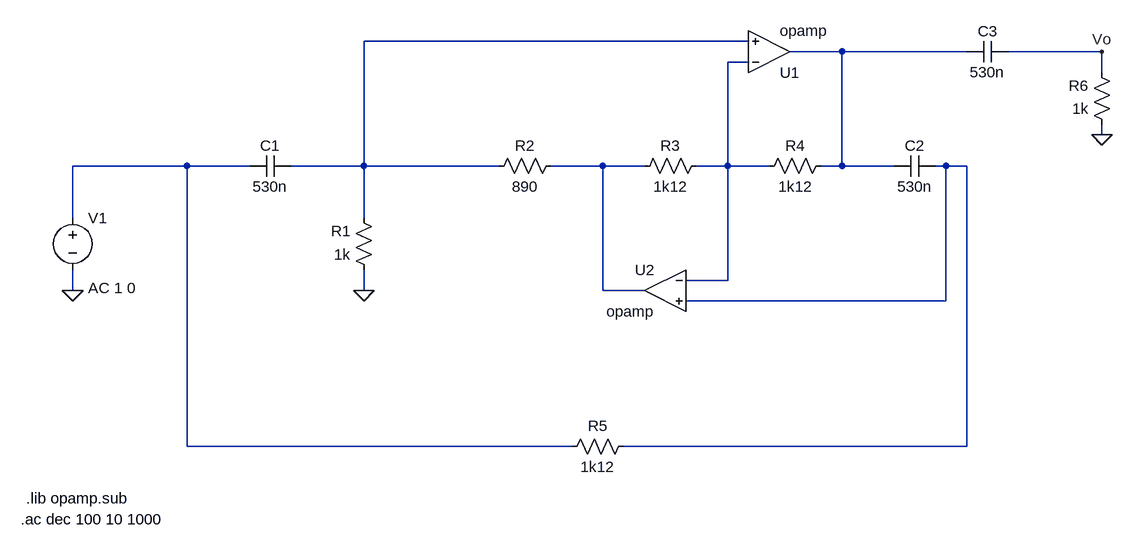
[diagram p0: schematic sim_circuital.asc]
sim_circuital.asc, the LTspice schematic file:
Version 4
SHEET 1 1048 680
WIRE 464 -256 -128 -256
WIRE 608 -240 528 -240
WIRE 800 -240 608 -240
WIRE 1008 -240 864 -240
WIRE 464 -224 432 -224
WIRE 1008 -208 1008 -240
WIRE 1008 -112 1008 -128
WIRE -400 -64 -576 -64
WIRE -304 -64 -400 -64
WIRE -128 -64 -128 -256
WIRE -128 -64 -240 -64
WIRE 80 -64 -128 -64
WIRE 240 -64 160 -64
WIRE 304 -64 240 -64
WIRE 432 -64 432 -224
WIRE 432 -64 384 -64
WIRE 496 -64 432 -64
WIRE 608 -64 608 -240
WIRE 608 -64 576 -64
WIRE 688 -64 608 -64
WIRE 768 -64 752 -64
WIRE 800 -64 768 -64
WIRE -576 16 -576 -64
WIRE -128 16 -128 -64
WIRE 432 112 432 -64
WIRE 432 112 368 112
WIRE -576 128 -576 96
WIRE -128 128 -128 96
WIRE 240 128 240 -64
WIRE 304 128 240 128
WIRE 768 144 768 -64
WIRE 768 144 368 144
WIRE -400 368 -400 -64
WIRE 192 368 -400 368
WIRE 800 368 800 -64
WIRE 800 368 272 368
FLAG -576 128 0
FLAG -128 128 0
FLAG 1008 -240 Vo
FLAG 1008 -112 0
SYMBOL res -112 112 R180
WINDOW 0 36 76 Left 2
WINDOW 3 36 40 Left 2
SYMATTR InstName R1
SYMATTR Value 1k
SYMBOL res 64 -48 R270
WINDOW 0 32 56 VTop 2
WINDOW 3 0 56 VBottom 2
SYMATTR InstName R2
SYMATTR Value 890
SYMBOL res 288 -48 R270
WINDOW 0 32 56 VTop 2
WINDOW 3 0 56 VBottom 2
SYMATTR InstName R3
SYMATTR Value 1k12
SYMBOL res 480 -48 R270
WINDOW 0 32 56 VTop 2
WINDOW 3 0 56 VBottom 2
SYMATTR InstName R4
SYMATTR Value 1k12
SYMBOL res 176 384 R270
WINDOW 0 32 56 VTop 2
WINDOW 3 0 56 VBottom 2
SYMATTR InstName R5
SYMATTR Value 1k12
SYMBOL cap -240 -80 R90
WINDOW 0 0 32 VBottom 2
WINDOW 3 32 32 VTop 2
SYMATTR InstName C1
SYMATTR Value 530n
SYMBOL cap 752 -80 R90
WINDOW 0 0 32 VBottom 2
WINDOW 3 32 32 VTop 2
SYMATTR InstName C2
SYMATTR Value 530n
SYMBOL voltage -576 0 R0
WINDOW 123 24 124 Left 2
WINDOW 39 0 0 Left 0
SYMATTR InstName V1
SYMATTR Value ""
SYMATTR Value2 AC 1 0
SYMBOL OpAmps\\opamp 496 -176 M180
SYMATTR InstName U1
SYMBOL OpAmps\\opamp 336 64 M0
SYMATTR InstName U2
SYMBOL res 1024 -112 R180
WINDOW 0 36 76 Left 2
WINDOW 3 36 40 Left 2
SYMATTR InstName R6
SYMATTR Value 1k
SYMBOL cap 864 -256 R90
WINDOW 0 0 32 VBottom 2
WINDOW 3 32 32 VTop 2
SYMATTR InstName C3
SYMATTR Value 530n
TEXT -648 448 Left 2 !.lib opamp.sub
TEXT -656 480 Left 2 !.ac dec 100 10 1000

The netlist it stands for:
* sim_circuital.asc
R1 0 N001 1k
R2 N001 N005 890
R3 N005 N003 1k12
R4 N003 N002 1k12
R5 N004 N006 1k12
C1 N001 N004 530n
C2 N006 N002 530n
V1 N004 0 AC 1 0
XU1 N003 N001 N002 opamp Aol=100K GBW=10Meg  ; pins invin noninvin out
XU2 N003 N006 N005 opamp Aol=100K GBW=10Meg  ; pins invin noninvin out
R6 0 Vo 1k
C3 Vo N002 530n
.lib opamp.sub
.ac dec 100 10 1000
.backanno
.end